# Altium project IMU.PrjPcb
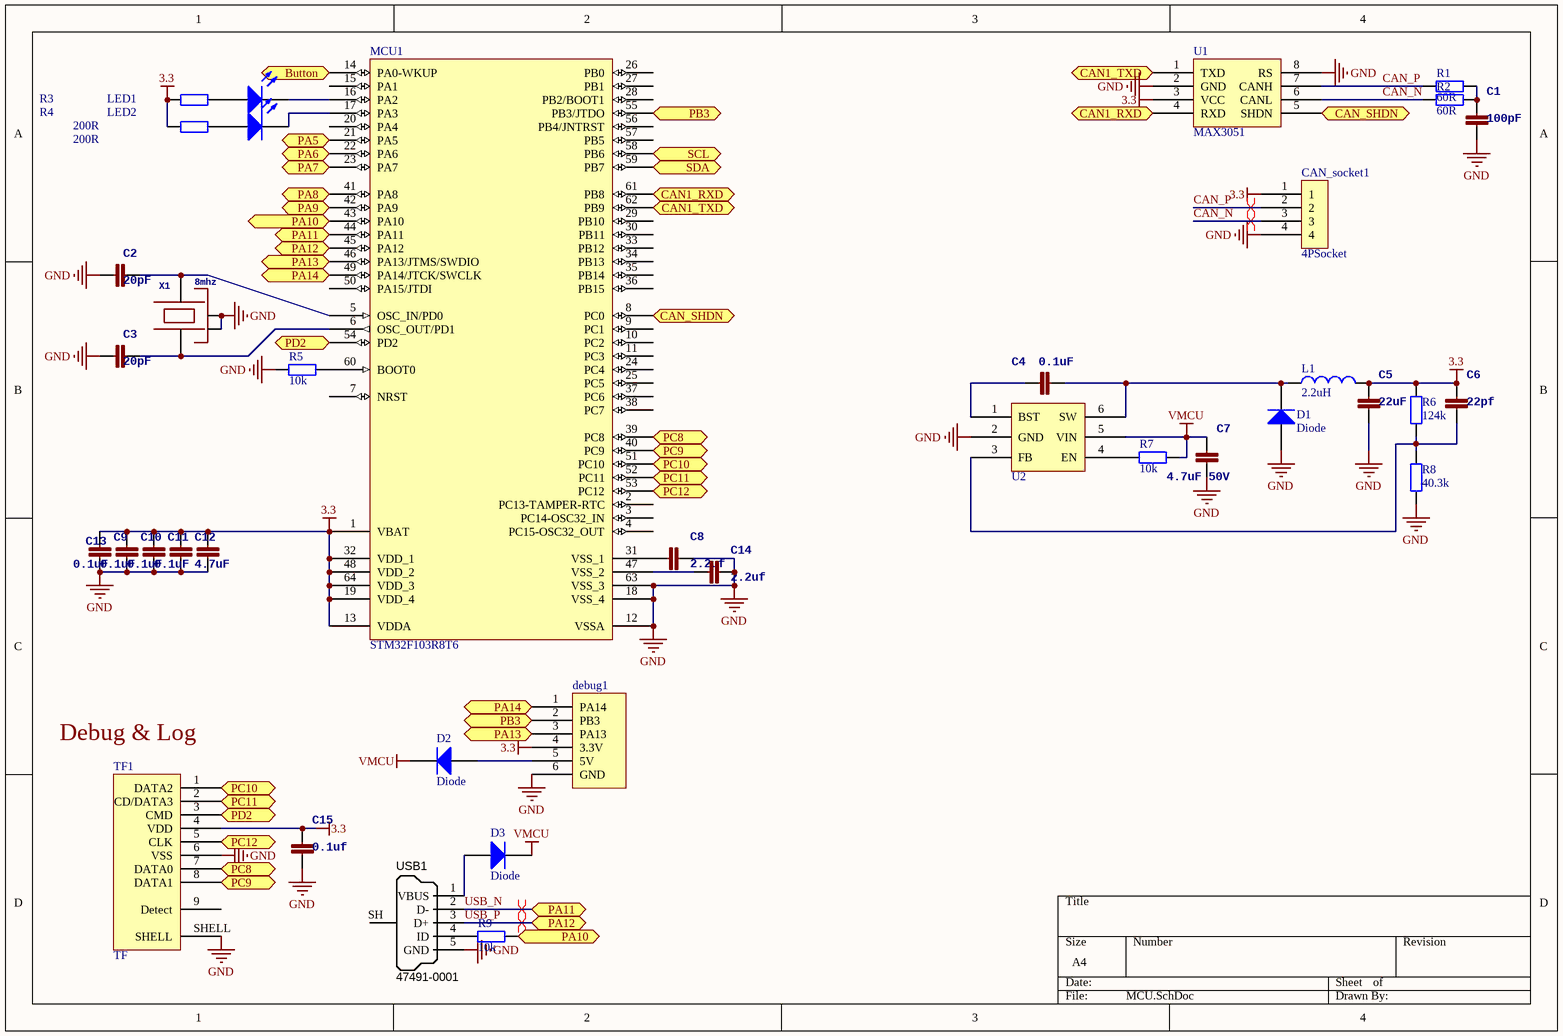
[diagram p0: MCU.SchDoc]
5 sheets, 70 parts. Net scope: flat (ports and power ports of the same name join across sheets).
Board file: IMU.PcbDoc
Sheets:
  MCU.SchDoc
  ADC.SchDoc
  IMU.SchDoc
  power.SchDoc
  IMU_VERTICAL.SchDoc

## Sheet MCU.SchDoc
size A4

### Parts
(Parts that share a designator on the sheet are numbered #1, #2 ... from top to bottom, then left to right.)
C1#1  100pF  [0402]
C2#1  20pF  [0603]
C3#1  20pF  [0603]
C4#1  0.1uF  [0402]
C5#1  22uF  [0805]
C6#1  22pf  [0402]
C7  4.7uF 50V  [0805]
C8  2.2uf  [0603]
C9  0.1uF  [0402]
C10  0.1uF  [0402]
C11  0.1uF  [0402]
C12  4.7uF  [0603]
C13  0.1uF  [0402]
C14  2.2uf  [0603]
C15  0.1uf  [0402]
CAN_socket1  4PSocket  [4pSocket-s]
D1  Diode  [0805]
D2  Diode  [0805]
D3  Diode  [0805]
debug1  debug  [WFRSM125]  (value not drawn)
L1  2.2uH  [1210]
LED1  LED0  [0603]  (value not drawn)
LED2  LED0  [0603]  (value not drawn)
MCU1  STM32F103R8T6  [LQFP64_N]
R1#1  60R  [0402]
R2#1  60R  [0402]
R3#1  200R  [0603]
R4#1  200R  [0603]
R5#1  10k  [0402]
R6#1  124k  [0402]
R7#1  10k  [0402]
R8#1  40.3k  [0402]
R9#1  10k  [0402]
TF1  TF  [TF]
U1  MAX3051  [SOT-8]
U2  MP2451  [SOT-23-6L]  (value not drawn)
USB1  Manufacturer Part Number 1: 47491-0001  [MOLEX-47346-0001]  (hidden comment: USB Micro Type B)
X1  8mhz  [OSCILLATOR-3.2X2.5]

### Ports
Button, CAN1_RXD, CAN1_TXD, CAN_SHDN, PA5, PA6, PA7, PA8, PA9, PA10, PA11, PA12, PA13, PA14, PB3, PC8, PC9, PC10, PC11, PC12, PD2, SCL, SDA

### Nets
3.3: C5#1.2 C6#1.2 C9.1 C10.1 C11.1 C12.2 C13.1 C15.2 CAN_socket1.1 debug1.4(3.3V) L1.2 MCU1.1(VBAT) MCU1.13(VDDA) MCU1.19(VDD_4) MCU1.32(VDD_1) MCU1.48(VDD_2) MCU1.64(VDD_3) R3#1.1 R4#1.1 R6#1.1 TF1.4(VDD) U1.3(VCC)
GND: C1#1.1 C2#1.2 C3#1.2 C5#1.1 C7.1 C8.2 C9.2 C10.2 C11.2 C12.1 C13.2 C14.2 C15.1 CAN_socket1.4 D1.1(A) debug1.6(GND) MCU1.12(VSSA) MCU1.18(VSS_4) MCU1.63(VSS_3) R5#1.2 R8#1.2 TF1.6(VSS) TF1.SHELL U1.2(GND) U1.8(RS) U2.2(GND) USB1.5(GND) X1.2(NC_2) X1.4(NC_4)
VMCU: C7.2 D2.2(K) D3.2(K) R7#1.2 U2.5(VIN)
CAN_N: CAN_socket1.3 R2#1.2 U1.6(CANL)
CAN_P: CAN_socket1.2 R1#1.2 U1.7(CANH)
USB_N: MCU1.44(PA11) USB1.2(D-) ; port PA11
USB_P: MCU1.45(PA12) USB1.3(D+) ; port PA12
NetC1#1_2: C1#1.2 R1#1.1 R2#1.1
NetC2#1_1: C2#1.1 MCU1.5(OSC_IN/PD0) X1.3
NetC3#1_1: C3#1.1 MCU1.6(OSC_OUT/PD1) X1.1
NetC4#1_1: C4#1.1 D1.2(K) L1.1 U2.6(SW)
NetC4#1_2: C4#1.2 U2.1(BST)
NetC6#1_1: C6#1.1 R6#1.2 R8#1.1 U2.3(FB)
NetC8_1: C8.1 MCU1.31(VSS_1)
NetC14_1: C14.1 MCU1.47(VSS_2)
NetD2_1: D2.1(A) debug1.5(5V)
NetD3_1: D3.1(A) USB1.1(VBUS)
Netdebug1_1: debug1.1(PA14) MCU1.49(PA14/JTCK/SWCLK) ; port PA14
Netdebug1_2: debug1.2(PB3) MCU1.55(PB3/JTDO) ; port PB3
Netdebug1_3: debug1.3(PA13) MCU1.46(PA13/JTMS/SWDIO) ; port PA13
NetLED1_1: LED1.1(A) R3#1.2
NetLED1_2: LED1.2(K) MCU1.16(PA2)
NetLED2_1: LED2.1(A) R4#1.2
NetLED2_2: LED2.2(K) MCU1.17(PA3)
NetMCU1_8: MCU1.8(PC0) U1.5(SHDN) ; port CAN_SHDN
NetMCU1_14: MCU1.14(PA0-WKUP) ; port Button
NetMCU1_21: MCU1.21(PA5) ; port PA5
NetMCU1_22: MCU1.22(PA6) ; port PA6
NetMCU1_23: MCU1.23(PA7) ; port PA7
NetMCU1_39: MCU1.39(PC8) TF1.7(DATA0) ; port PC8
NetMCU1_40: MCU1.40(PC9) TF1.8(DATA1) ; port PC9
NetMCU1_41: MCU1.41(PA8) ; port PA8
NetMCU1_42: MCU1.42(PA9) ; port PA9
NetMCU1_43: MCU1.43(PA10) R9#1.1 ; port PA10
NetMCU1_51: MCU1.51(PC10) TF1.1(DATA2) ; port PC10
NetMCU1_52: MCU1.52(PC11) TF1.2(CD/DATA3) ; port PC11
NetMCU1_53: MCU1.53(PC12) TF1.5(CLK) ; port PC12
NetMCU1_54: MCU1.54(PD2) TF1.3(CMD) ; port PD2
NetMCU1_58: MCU1.58(PB6) ; port SCL
NetMCU1_59: MCU1.59(PB7) ; port SDA
NetMCU1_60: MCU1.60(BOOT0) R5#1.1
NetMCU1_61: MCU1.61(PB8) U1.4(RXD) ; port CAN1_RXD
NetMCU1_62: MCU1.62(PB9) U1.1(TXD) ; port CAN1_TXD
NetR7#1_1: R7#1.1 U2.4(EN)
NetR9#1_2: R9#1.2 USB1.4(ID)

Not connected (* = marked no-connect by the designer): MCU1 2(PC13-TAMPER-RTC) 3(PC14-OSC32_IN) 4(PC15-OSC32_OUT) 7(NRST) 9(PC1) 10(PC2) 11(PC3) 15(PA1) 20(PA4) 24(PC4) 25(PC5) 26(PB0) 27(PB1) 28(PB2/BOOT1) 29(PB10) 30(PB11) 33(PB12) 34(PB13) 35(PB14) 36(PB15) 37(PC6) 38(PC7) 50(PA15/JTDI) 56(PB4/JNTRST) 57(PB5); TF1 9(Detect); USB1 SH(Shell)

### Layout directives
differential pair: CAN_N, CAN_P, USB_N, USB_P

### Notes on the sheet
- (near TF1) Debug & Log

### Library data of the parts
C1#1 C2#1 C3#1 C4#1 C5#1 C6#1 C7-C15 = CAP0402-CAP: 电容; PARTNO: CC0402ZRY5V7BB104
D1-D3 = Diode: Default Diode; Published: 8-Jun-2000; LatestRevisionDate: 17-Jul-2002; LatestRevisionNote: Re-released for DXP Platform.; PackageVersion: Sep-1996; PackageReference: SMC; Publisher: Altium Limited; PackageDescription: DO-214-AB/SMC; 2 C-Bend Leads; Body 7.9 x 5.9 mm, inc. leads (LxW); Code_JEDEC: DO-214-AB
L1 = Inductor: Code_IEC: 1005; Value: 10mH; Published: 8-Jun-2000; LatestRevisionDate: 29-May-2009; LatestRevisionNote: IPC-7351 Footprint Added.; PackageReference: 0402-A; Publisher: Altium Limited; PackageDescription: Chip Inductor; Code_JEITA: 0402
LED1 LED2 = LED0: Typical INFRARED GaAs LED; Published: 8-Jun-2000; LatestRevisionDate: 08-Jul-2005; LatestRevisionNote: Mech Layer 1 removed.; PackageReference: LED-0; Publisher: Altium Limited; PackageDescription: LED; 2 Leads
MCU1 = STM32F103R8T6: STM32 ARM-based 32-bit MCU with 64 Kbytes Flash, 64-pin LQFP, Industrial Temperature; Published: *; DatasheetVersion: *; PackageVersion: *; PackageReference: *; Publisher: *; PackageDescription: *; ComponentLink1Description: *; ComponentLink1URL: *; ComponentLink2Description: *; ComponentLink2URL: *
R1#1 R2#1 R3#1 R4#1 R5#1 R6#1 R7#1 R8#1 R9#1 = Res2: 电阻; Value: 0Ohm; Published: 8-Jun-2000; LatestRevisionDate: 17-Jul-2002; LatestRevisionNote: Re-released for DXP Platform.; PackageReference: AXIAL-0.4; Publisher: Altium Limited; PackageDescription: Axial Device, Thru-Hole; 2 Leads; 0.4 in Pin Spacing
USB1 = USB_Micro_TypeB: Connector SMD USB Micro Type B middle mount; Manufacturer 1: Molex Inc; SCDType: undef; Package / Case: SMD; Supplier 1: Digi-Key; Supplier Part Number 1: WM17142CT-ND
X1 = OSCILLATOR-3.2X2.5: Crystal Oscillator in 3.2x2.5 SMD

## Sheet ADC.SchDoc
size A4
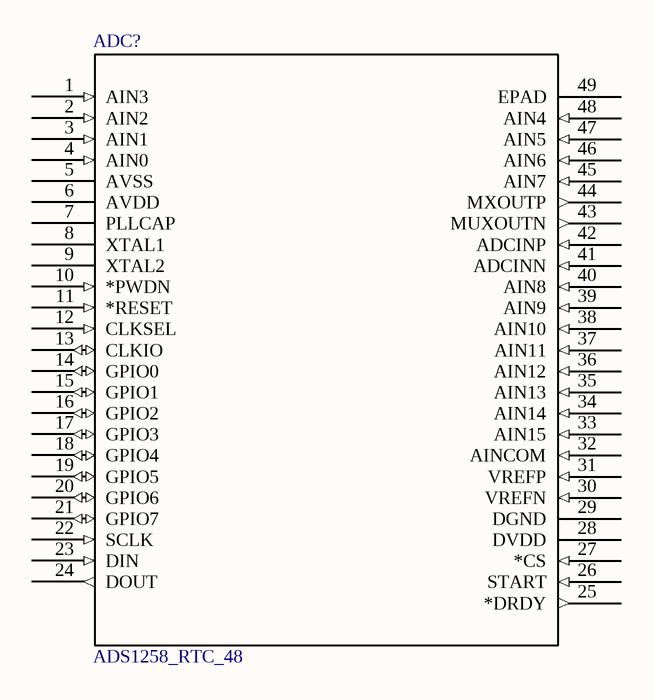
[diagram p1: ADC.SchDoc]

### Parts
ADC?  ADS1258_RTC_48  [RTC48_5P1X5P1 - weak]

### Nets

Not connected (* = marked no-connect by the designer): ADC? 1(AIN3) 2(AIN2) 3(AIN1) 4(AIN0) 5(AVSS) 6(AVDD) 7(PLLCAP) 8(XTAL1) 9(XTAL2) 10(*PWDN) 11(*RESET) 12(CLKSEL) 13(CLKIO) 14(GPIO0) 15(GPIO1) 16(GPIO2) 17(GPIO3) 18(GPIO4) 19(GPIO5) 20(GPIO6) 21(GPIO7) 22(SCLK) 23(DIN) 24(DOUT) 25(*DRDY) 26(START) 27(*CS) 28(DVDD) 29(DGND) 30(VREFN) 31(VREFP) 32(AINCOM) 33(AIN15) 34(AIN14) 35(AIN13) 36(AIN12) 37(AIN11) 38(AIN10) 39(AIN9) 40(AIN8) 41(ADCINN) 42(ADCINP) 43(MUXOUTN) 44(MXOUTP) 45(AIN7) 46(AIN6) 47(AIN5) 48(AIN4) 49(EPAD)

### Library data of the parts
ADC? = ADS1258_RTC_48: Imported; Manufacturer: Texas Instruments; INDUSTRY_STD_PKG_TYPE: VQFN; FAMILY_NAME: PRECISION ADC (<=10MSPS); PIN_COUNT: 48; PACKAGE_DESIGNATOR: RTC; Datasheet URL: http://www.ti.com/lit/gpn/ADS1258; GENERIC_PART_NUMBER: ADS1258; RefDes: RefDes; Type: DEV; Value: Value

## Sheet IMU.SchDoc
size A4
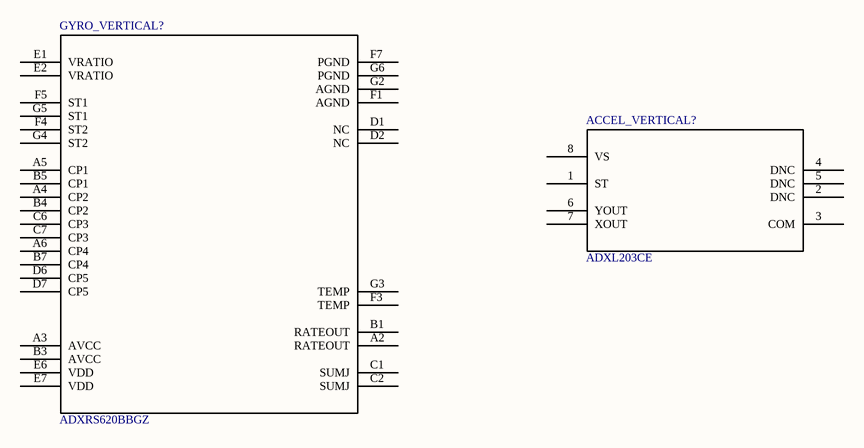
[diagram p2: IMU.SchDoc]

### Parts
ACCEL_VERTICAL?  ADXL203CE  [ADXL203]
GYRO_VERTICAL?  ADXRS620BBGZ  [BG_32_3]

### Nets

Not connected (* = marked no-connect by the designer): ACCEL_VERTICAL? 1(ST) 2(DNC) 3(COM) 4(DNC) 5(DNC) 6(YOUT) 7(XOUT) 8(VS); GYRO_VERTICAL? A2(RATEOUT) A3(AVCC) A4(CP2) A5(CP1) A6(CP4) B1(RATEOUT) B3(AVCC) B4(CP2) B5(CP1) B7(CP4) C1(SUMJ) C2(SUMJ) C6(CP3) C7(CP3) D1(NC) D2(NC) D6(CP5) D7(CP5) E1(VRATIO) E2(VRATIO) E6(VDD) E7(VDD) F1(AGND) F3(TEMP) F4(ST2) F5(ST1) F7(PGND) G2(AGND) G3(TEMP) G4(ST2) G5(ST1) G6(PGND)

### Library data of the parts
ACCEL_VERTICAL? = ADXL203CE: Imported; RefDes: RefDes; Type: DEV; Value: Value
GYRO_VERTICAL? = ADXRS620BBGZ: Imported; Manufacturer_Part_Number: ADXRS613BBGZ; Vendor: Vendor; RefDes: RefDes; Type: DEV; Value: Value

## Sheet power.SchDoc
size A4
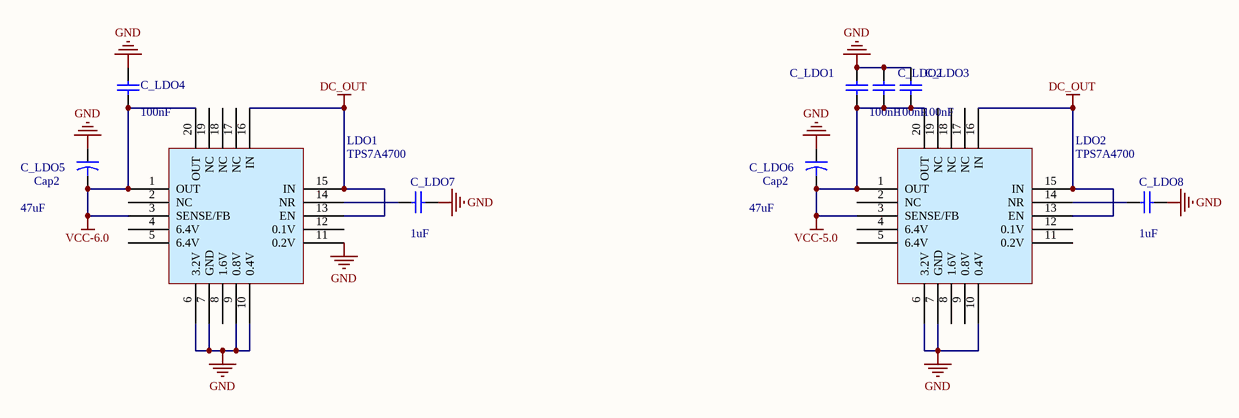
[diagram p3: power.SchDoc]

### Parts
C_LDO1  value 100nF  [0805]
C_LDO2  value 100nF  [0805]
C_LDO3  value 100nF  [0805]
C_LDO4  value 100nF  [0805]
C_LDO5  Cap2  value 47uF  [1210]
C_LDO6  Cap2  value 47uF  [1210]
C_LDO7  value 1uF  [0603]
C_LDO8  value 1uF  [0603]
LDO1  TPS7A4700  [TPS7A4700 - b]
LDO2  TPS7A4700  [TPS7A4700 - b]

### Nets
DC_OUT: LDO1.13(EN) LDO1.15(IN) LDO1.16(IN) LDO2.13(EN) LDO2.15(IN) LDO2.16(IN)
GND: C_LDO1.1 C_LDO2.1 C_LDO3.1 C_LDO4.1 C_LDO5.1 C_LDO6.1 C_LDO7.1 C_LDO8.1 LDO1.6(3.2V) LDO1.7(GND) LDO1.9(0.8V) LDO1.10(0.4V) LDO1.11(0.2V) LDO2.6(3.2V) LDO2.7(GND) LDO2.10(0.4V)
VCC-5.0: C_LDO1.2 C_LDO2.2 C_LDO3.2 C_LDO6.2 LDO2.1(OUT) LDO2.3(SENSE/FB) LDO2.20(OUT)
VCC-6.0: C_LDO4.2 C_LDO5.2 LDO1.1(OUT) LDO1.3(SENSE/FB) LDO1.20(OUT)
NetC_LDO7_2: C_LDO7.2 LDO1.14(NR)
NetC_LDO8_2: C_LDO8.2 LDO2.14(NR)

Not connected (* = marked no-connect by the designer): LDO1 2(NC) 4(6.4V) 5(6.4V) 8(1.6V) 12(0.1V) 17(NC) 18(NC) 19(NC); LDO2 2(NC) 4(6.4V) 5(6.4V) 8(1.6V) 9(0.8V) 11(0.2V) 12(0.1V) 17(NC) 18(NC) 19(NC)

### Library data of the parts
C_LDO1-C_LDO4 C_LDO7 C_LDO8 = Cap: Capacitor; Published: 8-Jun-2000; LatestRevisionDate: 17-Jul-2002; LatestRevisionNote: Re-released for DXP Platform.; PackageReference: RAD-0.3; Publisher: Altium Limited; PackageDescription: Radial Cap, Thru-Hole; 2 Leads; 0.3 in Pin Spacing
C_LDO5 C_LDO6 = Cap2: Capacitor; Published: 23-Sep-2002; PackageReference: CAPR5-4X5; Publisher: Altium Limited; PackageDescription: Capacitor; 2 Leads

## Sheet IMU_VERTICAL.SchDoc
size A4
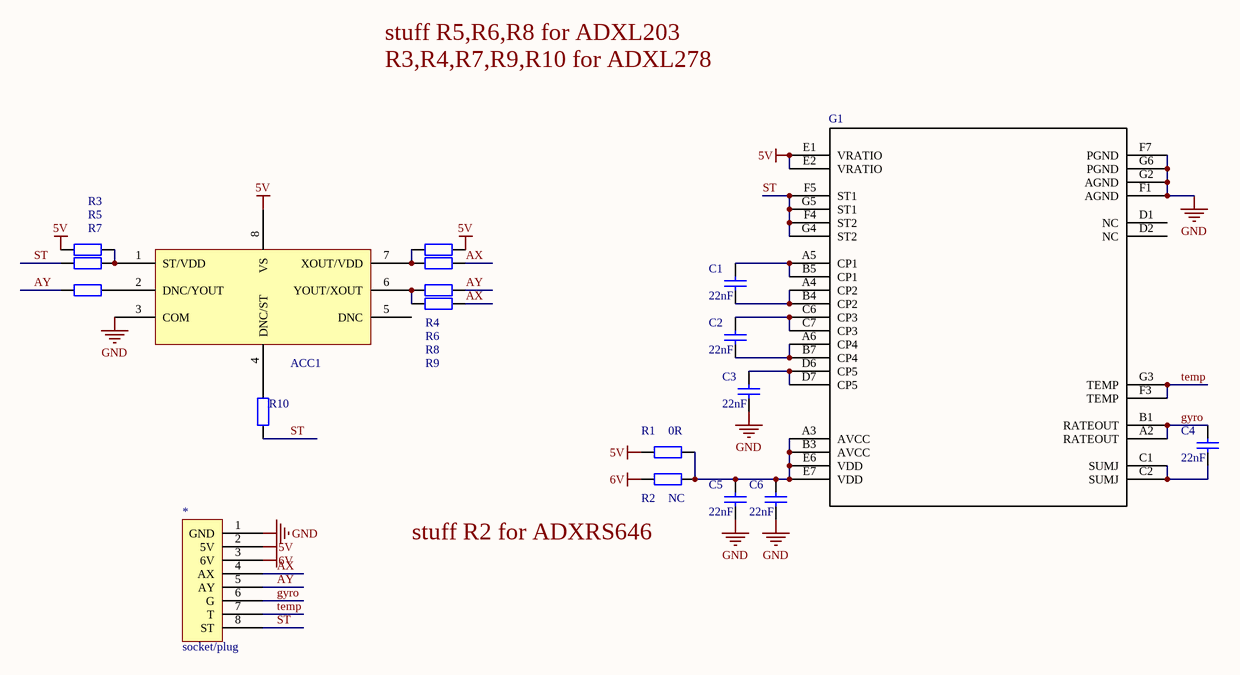
[diagram p4: IMU_VERTICAL.SchDoc]

### Parts
(Parts that share a designator on the sheet are numbered #1, #2 ... from top to bottom, then left to right.)
*  socket/plug  [plug]
ACC1  ACC-8  [ADXL203]  (value not drawn)
C1#2  value 22nF  [0402]  (hidden comment: Cap)
C2#2  value 22nF  [0402]  (hidden comment: Cap)
C3#2  value 22nF  [0402]  (hidden comment: Cap)
C4#2  value 22nF  [0402]  (hidden comment: Cap)
C5#2  value 22nF  [0402]  (hidden comment: Cap)
C6#2  value 22nF  [0402]  (hidden comment: Cap)
G1  ADXRS620BBGZ  [BG_32_3]  (value not drawn)
R1#2  value 0R  [0402]
R2#2  value NC  [0402]
R3#2  (no value)  [0402]
R4#2  (no value)  [0402]
R5#2  (no value)  [0402]
R6#2  (no value)  [0402]
R7#2  (no value)  [0402]
R8#2  (no value)  [0402]
R9#2  (no value)  [0402]
R10  (no value)  [0402]

### Nets
5V: *.2(5V) ACC1.8(VS) G1.E1(VRATIO) G1.E2(VRATIO) R1#2.1 R3#2.1 R4#2.2
6V: *.3(6V) R2#2.1
GND: *.1(GND) ACC1.3(COM) C3#2.1 C5#2.1 C6#2.1 G1.F1(AGND) G1.F7(PGND) G1.G2(AGND) G1.G6(PGND)
AX: *.4(AX) R6#2.2 R9#2.2
AY: *.5(AY) R7#2.1 R8#2.2
gyro: *.6(G) C4#2.2 G1.A2(RATEOUT) G1.B1(RATEOUT)
ST: *.8(ST) G1.F4(ST2) G1.F5(ST1) G1.G4(ST2) G1.G5(ST1) R5#2.1 R10.1
temp: *.7(T) G1.F3(TEMP) G1.G3(TEMP)
NetACC1_1: ACC1.1(ST/VDD) R3#2.2 R5#2.2
NetACC1_2: ACC1.2(DNC/YOUT) R7#2.2
NetACC1_4: ACC1.4(DNC/ST) R10.2
NetACC1_6: ACC1.6(YOUT/XOUT) R8#2.1 R9#2.1
NetACC1_7: ACC1.7(XOUT/VDD) R4#2.1 R6#2.1
NetC1#2_1: C1#2.1 G1.A4(CP2) G1.B4(CP2)
NetC1#2_2: C1#2.2 G1.A5(CP1) G1.B5(CP1)
NetC2#2_1: C2#2.1 G1.A6(CP4) G1.B7(CP4)
NetC2#2_2: C2#2.2 G1.C6(CP3) G1.C7(CP3)
NetC3#2_2: C3#2.2 G1.D6(CP5) G1.D7(CP5)
NetC4#2_1: C4#2.1 G1.C1(SUMJ) G1.C2(SUMJ)
NetC5#2_2: C5#2.2 C6#2.2 G1.A3(AVCC) G1.B3(AVCC) G1.E6(VDD) G1.E7(VDD) R1#2.2 R2#2.2

Not connected (* = marked no-connect by the designer): ACC1 5(DNC); G1 D1(NC) D2(NC)

### Notes on the sheet
- stuff R5,R6,R8 for ADXL203
- R3,R4,R7,R9,R10 for ADXL278
- (near R2#2) stuff R2 for ADXRS646

### Library data of the parts
ACC1 = ACC-8: Imported; RefDes: RefDes; Type: DEV; Value: Value
C1#2 C2#2 C3#2 C4#2 C5#2 C6#2 = Cap: Capacitor; Published: 8-Jun-2000; LatestRevisionDate: 17-Jul-2002; LatestRevisionNote: Re-released for DXP Platform.; PackageReference: RAD-0.3; Publisher: Altium Limited; PackageDescription: Radial Cap, Thru-Hole; 2 Leads; 0.3 in Pin Spacing
G1 = ADXRS620BBGZ: as GYRO_VERTICAL? on sheet IMU; Vendor: Vendor; RefDes: RefDes; Type: DEV; Value: Value
R1#2 R2#2 = Res2: Resistor; Published: 8-Jun-2000; LatestRevisionDate: 17-Jul-2002; LatestRevisionNote: Re-released for DXP Platform.; PackageReference: AXIAL-0.4; Publisher: Altium Limited; PackageDescription: Axial Device, Thru-Hole; 2 Leads; 0.4 in Pin Spacing
R3#2 R4#2 R5#2 R6#2 R7#2 R8#2 R9#2 R10 = Res2: Resistor; Value: 0R; Published: 8-Jun-2000; LatestRevisionDate: 17-Jul-2002; LatestRevisionNote: Re-released for DXP Platform.; PackageReference: AXIAL-0.4; Publisher: Altium Limited; PackageDescription: Axial Device, Thru-Hole; 2 Leads; 0.4 in Pin Spacing

## Nets that join several sheets
GND: MCU (29 pins), power (16 pins), IMU_VERTICAL (9 pins)